# Altium schematic sheet Sheet4.SchDoc
size A4
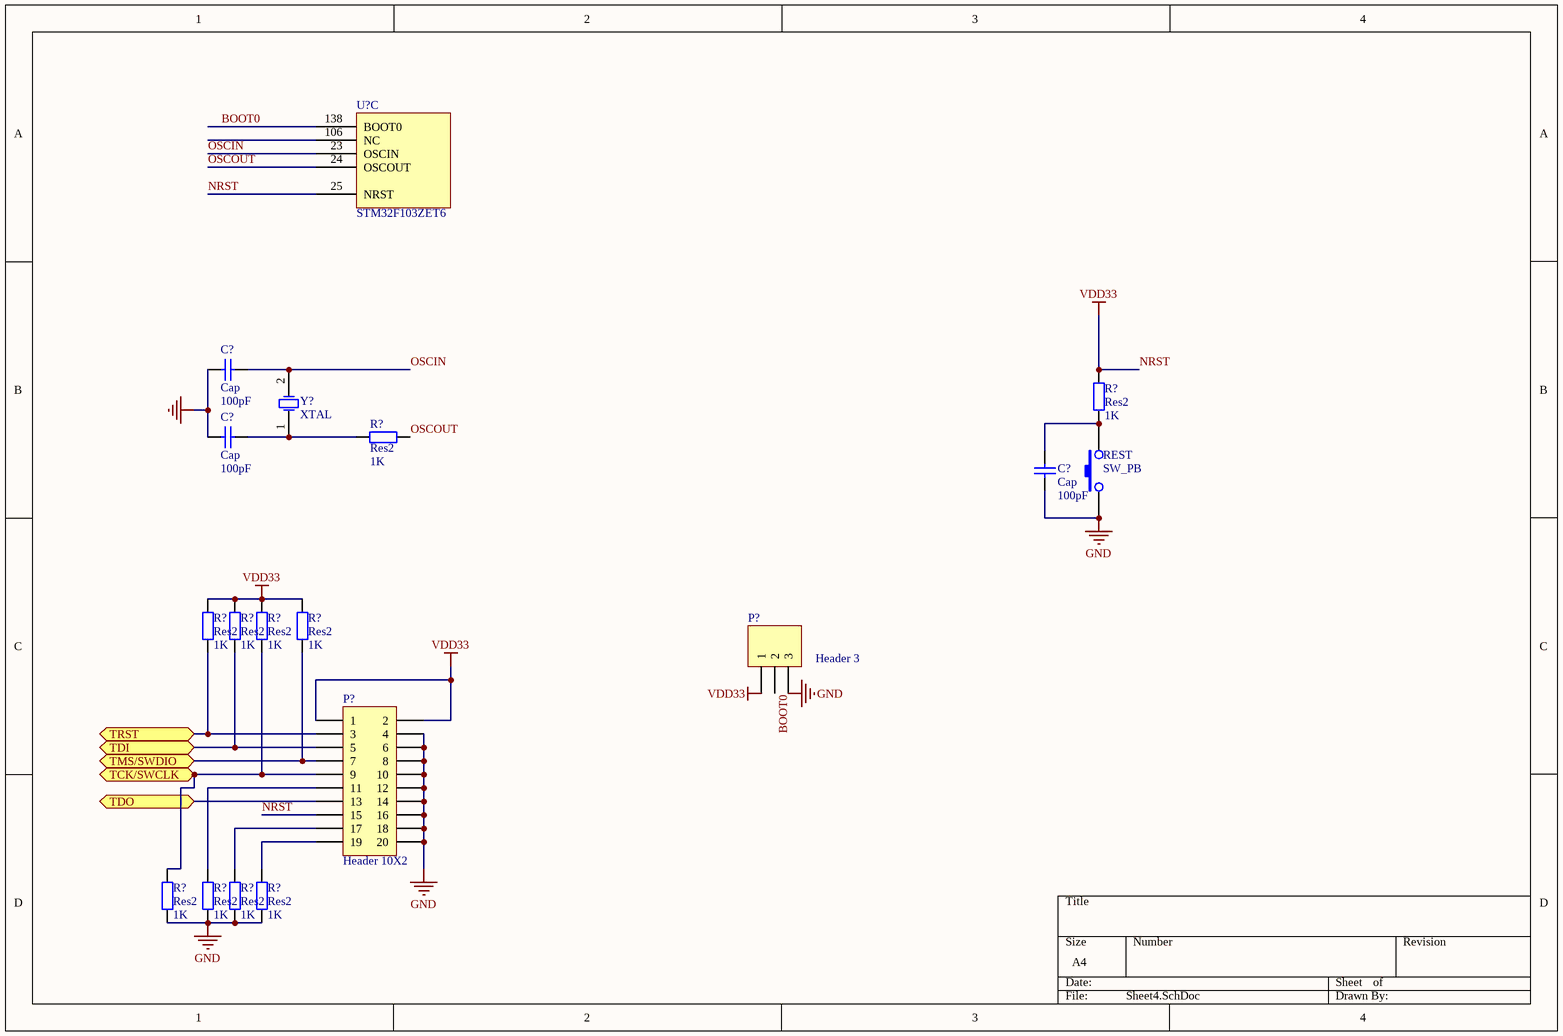
[diagram p0: Sheet4.SchDoc]

## Parts
(Parts that share a designator on the sheet are numbered #1, #2 ... from top to bottom, then left to right.)
C?#1  Cap  value 100pF  [RAD-0.3]
C?#2  Cap  value 100pF  [RAD-0.3]
C?#3  Cap  value 100pF  [RAD-0.3]
P?#1  Header 3  [HDR1X3]
P?#2  Header 10X2  [HDR2X10]
R?#1  Res2  value 1K  [AXIAL-0.4]
R?#2  Res2  value 1K  [AXIAL-0.4]
R?#3  Res2  value 1K  [AXIAL-0.4]
R?#4  Res2  value 1K  [AXIAL-0.4]
R?#5  Res2  value 1K  [AXIAL-0.4]
R?#6  Res2  value 1K  [AXIAL-0.4]
R?#7  Res2  value 1K  [AXIAL-0.4]
R?#8  Res2  value 1K  [AXIAL-0.4]
R?#9  Res2  value 1K  [AXIAL-0.4]
R?#10  Res2  value 1K  [AXIAL-0.4]
REST  SW_PB  [SWPB]
U?  STM32F103ZET6  (part C of 3)
Y?  XTAL  [R38]

## Ports
TCK/SWCLK (bidir), TDI (bidir), TDO (bidir), TMS/SWDIO (bidir), TRST (bidir)

## Nets
GND: C?#1.1 C?#2.1 C?#3.1 P?#1.3 P?#2.4 P?#2.6 P?#2.8 P?#2.10 P?#2.12 P?#2.14 P?#2.16 P?#2.18 P?#2.20 R?#7.2 R?#8.2 R?#9.2 R?#10.2 REST.1
NRST: P?#1.1 P?#2.1 P?#2.2 P?#2.15 R?#1.2 R?#3.2 R?#4.2 R?#5.2 R?#6.2 U?.25(NRST)  [also labelled VDD33]
BOOT0: P?#1.2 U?.138(BOOT0)
OSCIN: C?#1.2 U?.23(OSCIN) Y?.2(OSC2)
OSCOUT: R?#2.2 U?.24(OSCOUT)
TCK/SWCLK: P?#2.9 R?#5.1 R?#7.1 ; port TCK/SWCLK
TDI: P?#2.5 R?#4.1 ; port TDI
TDO: P?#2.13 ; port TDO
TMS/SWDIO: P?#2.7 R?#6.1 ; port TMS/SWDIO
TRST: P?#2.3 R?#3.1 ; port TRST
NetC?#2_2: C?#2.2 R?#2.1 Y?.1(OSC1)
NetC?#3_2: C?#3.2 R?#1.1 REST.2
NetP?#2_11: P?#2.11 R?#8.1
NetP?#2_17: P?#2.17 R?#9.1
NetP?#2_19: P?#2.19 R?#10.1

Not connected (* = marked no-connect by the designer): U? 106(NC)

## Library data of the parts
C?#1-C?#3 = Cap: Capacitor; Published: 8-Jun-2000; LatestRevisionDate: 17-Jul-2002; LatestRevisionNote: Re-released for DXP Platform.; PackageReference: RAD-0.3; Publisher: Altium Limited
P?#1 = Header 3: Header, 3-Pin; LatestRevisionDate: 17-Jul-2002; LatestRevisionNote: Re-released for DXP Platform.; Publisher: Altium Limited
P?#2 = Header 10X2: Header, 10-Pin, Dual row; LatestRevisionDate: 17-Jul-2002; LatestRevisionNote: Re-released for DXP Platform.; Publisher: Altium Limited
R?#1-R?#10 = Res2: Resistor; Published: 8-Jun-2000; LatestRevisionDate: 17-Jul-2002; LatestRevisionNote: Re-released for DXP Platform.; PackageReference: AXIAL-0.4; Publisher: Altium Limited
Y? = XTAL: Crystal Oscillator; Published: 8-Jun-2000; LatestRevisionDate: 17-Jul-2002; LatestRevisionNote: Re-released for DXP Platform.; PackageReference: R38; Publisher: Altium Limited